# EAGLE schematic K66 (EAGLE 7.7.0)
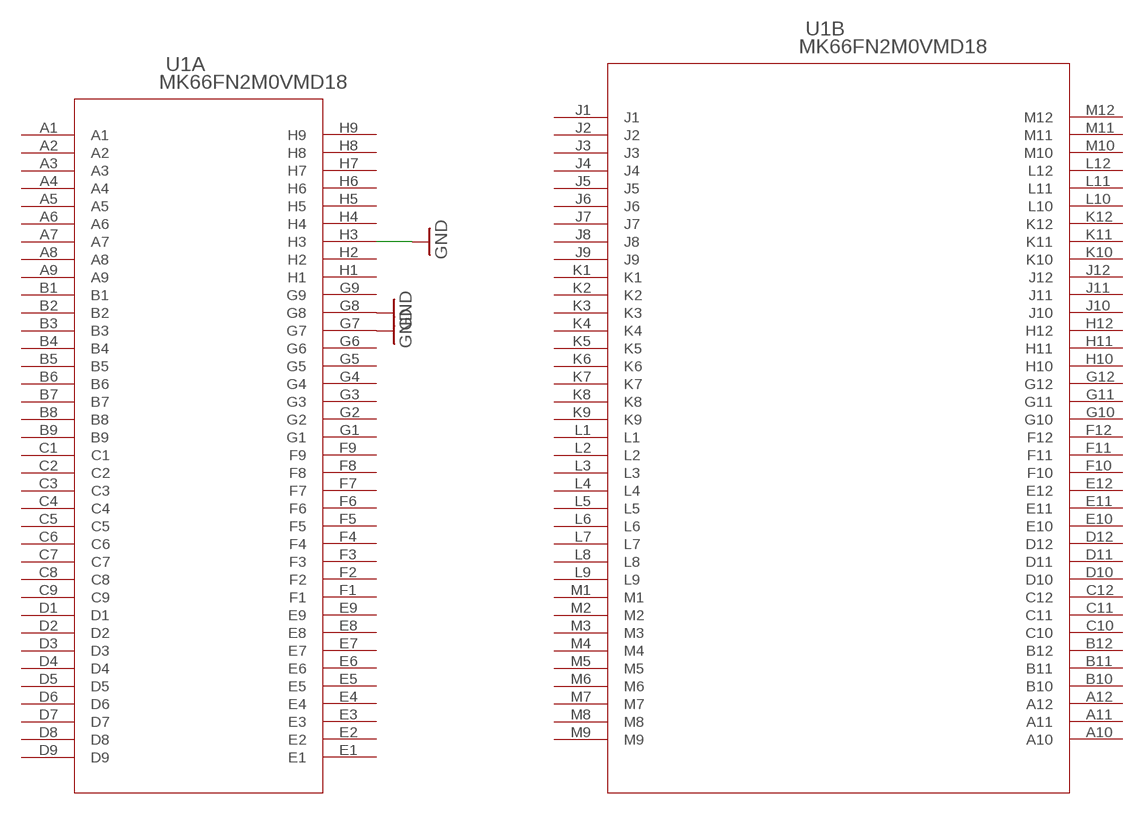
[diagram p0: schematic, sheet 1]

## Parts
U1  MK66FN2M0VMD18  [98ASA00222D]

## Nets
GND: U1.G7(A:G7) U1.G8(A:G8) U1.H3(A:H3)
Unconnected: U1.A1(A:A1) U1.A2(A:A2) U1.A3(A:A3) U1.A4(A:A4) U1.A5(A:A5) U1.A6(A:A6) U1.A7(A:A7) U1.A8(A:A8) U1.A9(A:A9) U1.A10(B:A10) U1.A11(B:A11) U1.A12(B:A12) U1.B1(A:B1) U1.B2(A:B2) U1.B3(A:B3) U1.B4(A:B4) U1.B5(A:B5) U1.B6(A:B6) U1.B7(A:B7) U1.B8(A:B8) U1.B9(A:B9) U1.B10(B:B10) U1.B11(B:B11) U1.B12(B:B12) U1.C1(A:C1) U1.C2(A:C2) U1.C3(A:C3) U1.C4(A:C4) U1.C5(A:C5) U1.C6(A:C6) U1.C7(A:C7) U1.C8(A:C8) U1.C9(A:C9) U1.C10(B:C10) U1.C11(B:C11) U1.C12(B:C12) U1.D1(A:D1) U1.D2(A:D2) U1.D3(A:D3) U1.D4(A:D4) U1.D5(A:D5) U1.D6(A:D6) U1.D7(A:D7) U1.D8(A:D8) U1.D9(A:D9) U1.D10(B:D10) U1.D11(B:D11) U1.D12(B:D12) U1.E1(A:E1) U1.E2(A:E2) U1.E3(A:E3) U1.E4(A:E4) U1.E9(A:E9) U1.E10(B:E10) U1.E11(B:E11) U1.E12(B:E12) U1.F1(A:F1) U1.F2(A:F2) U1.F3(A:F3) U1.F4(A:F4) U1.F9(A:F9) U1.F10(B:F10) U1.F11(B:F11) U1.F12(B:F12) U1.G1(A:G1) U1.G2(A:G2) U1.G3(A:G3) U1.G4(A:G4) U1.G9(A:G9) U1.G10(B:G10) U1.G11(B:G11) U1.G12(B:G12) U1.H1(A:H1) U1.H2(A:H2) U1.H4(A:H4) U1.H9(A:H9) U1.H10(B:H10) U1.H11(B:H11) U1.H12(B:H12) U1.J1(B:J1) U1.J2(B:J2) U1.J3(B:J3) U1.J4(B:J4) U1.J5(B:J5) U1.J6(B:J6) U1.J7(B:J7) U1.J8(B:J8) U1.J9(B:J9) U1.J10(B:J10) U1.J11(B:J11) U1.J12(B:J12) U1.K1(B:K1) U1.K3(B:K3) U1.K4(B:K4) U1.K5(B:K5) U1.K6(B:K6) U1.K7(B:K7) U1.K8(B:K8) U1.K9(B:K9) U1.K10(B:K10) U1.K11(B:K11) U1.K12(B:K12) U1.L1(B:L1) U1.L2(B:L2) U1.L3(B:L3) U1.L4(B:L4) U1.L5(B:L5) U1.L7(B:L7) U1.L8(B:L8) U1.L9(B:L9) U1.L10(B:L10) U1.L11(B:L11) U1.L12(B:L12) U1.M1(B:M1) U1.M2(B:M2) U1.M3(B:M3) U1.M4(B:M4) U1.M5(B:M5) U1.M6(B:M6) U1.M7(B:M7) U1.M8(B:M8) U1.M9(B:M9) U1.M11(B:M11) U1.M12(B:M12)

## Power pins joined to a net without a drawn wire
E5: U1.E5(A:E5)
E6: U1.E6(A:E6)
E7: U1.E7(A:E7)
E8: U1.E8(A:E8)
F5: U1.F5(A:F5)
F6: U1.F6(A:F6)
F7: U1.F7(A:F7)
F8: U1.F8(A:F8)
G5: U1.G5(A:G5)
G6: U1.G6(A:G6)
H5: U1.H5(A:H5)
H6: U1.H6(A:H6)
H7: U1.H7(A:H7)
H8: U1.H8(A:H8)
K2: U1.K2(B:K2)
L6: U1.L6(B:L6)
M10: U1.M10(B:M10)

## Library data of the parts
U1 = K66-BGA:MK66FN2M0VMD18; MANUFACTURER_PART_NUMBER: mk66fn2m0vmd18; VENDOR: Freescale